# EAGLE design charger-test_2L (EAGLE 7.7.0)
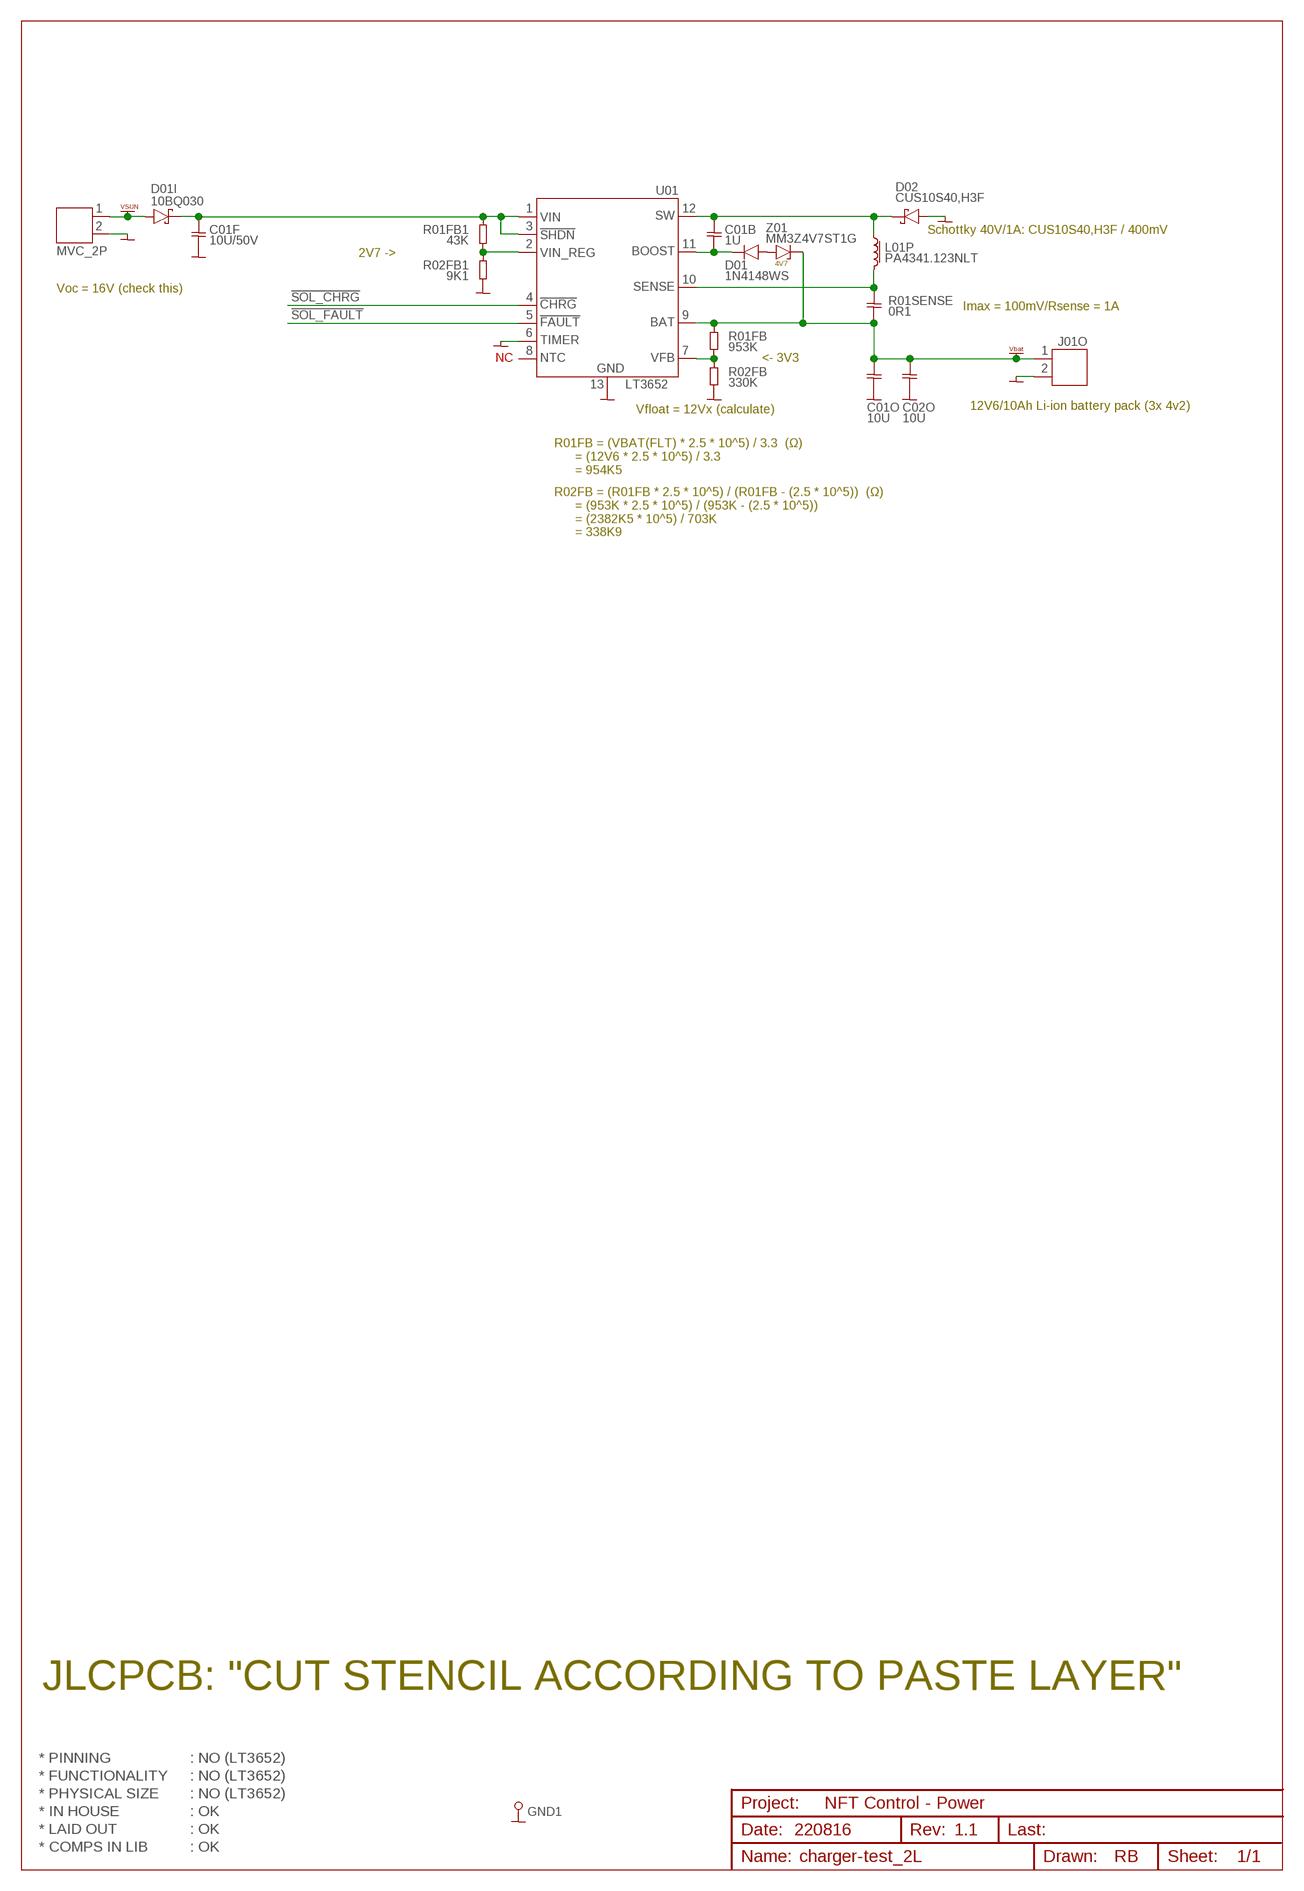
[diagram p0: schematic, sheet 1]

## Parts
C01B  1U  CAP0402  [CAP0402]
C01F  10U/50V  CAP0805  [CAP0805]
C01O  10U  CAP0805  [CAP0805]
C02O  10U  CAP0805  [CAP0805]
D01  1N4148WS  DIODE_1N4148WS  [DIODE_SOD323]
D01I  10BQ030  DIODE_10BQ030  [DIODE_SMB]
D02  CUS10S40,H3F  DIODE_SCHOTTKY_SOD323  [DIODE_SOD323]
GND1  PIN_TEST  [HOLE_PTH_0.8MM]
J01I  MVC_2P  CON_PHOENIX_COMBICON_MCV_HEADER_2P  [CON_PHOENIX_COMBICON_MCV_HEADER_P]
J01O  CON_PHOENIX_COMBICON_MCV_HEADER_2P  [CON_PHOENIX_COMBICON_MCV_HEADER_P]
L01P  PA4341.123NLT  L_PA4341  [L_PA4341]
R01FB  953K  RES0402  [RES0402]
R01FB1  43K  RES0603  [RES0603]
R01SENSE  0R1  CAP0603  [CAP0603]
R02FB  330K  RES0402  [RES0402]
R02FB1  9K1  RES0603  [RES0603]
U01  LT3652  [MSOP-12_GND]
Z01  MM3Z4V7ST1G  ZENER_SOD323  [ZENER_SOD323]

## Nets
!SOL_CHRG: U01.4(4.!CHRG)
!SOL_FAULT: U01.5(5.!FAULT)
BOOST: C01B.2 D01.C(-) U01.11(11.BOOST)
GND: C01F.2 C01O.2 C02O.2 D02.A GND1.1 J01I.2 J01O.2 R02FB1.1 R02FB.1 U01.6(6.TIMER) U01.13(GND_PAD)
N$10: C01F.1 D01I.C(-) R01FB1.2 U01.1(1.VIN) U01.3(3.!SHDN)
N$26: D01.A(+) Z01.A
N$27: R01FB1.1 R02FB1.2 U01.2(2.VIN_REG)
SENSE: L01P.P$2 R01SENSE.2 U01.10(10.SENSE)
SW: C01B.1 D02.C L01P.P$1 U01.12(12.SW)
VBAT: C01O.1 C02O.1 J01O.1 R01FB.2 R01SENSE.1 U01.9(9.BAT) Z01.C
VFB: R01FB.1 R02FB.2 U01.7(7.VFB)
VSUN: D01I.A(+) J01I.1
Unconnected: U01.8(8.NTC)

## Notes on the sheet
- Schottky 40V/1A: CUS10S40,H3F / 400mV
- 2V7 ->
- 4V7
- Voc = 16V (check this)
- Imax = 100mV/Rsense = 1A
- NC | <- 3V3
- Vfloat = 12Vx (calculate) | 12V6/10Ah Li-ion battery pack (3x 4v2)
- R01FB = (VBAT(FLT) * 2.5 * 10^5) / 3.3  (Ω)
        = (12V6 * 2.5 * 10^5) / 3.3
        = 954K5
- R02FB = (R01FB * 2.5 * 10^5) / (R01FB - (2.5 * 10^5))  (Ω)
        = (953K * 2.5 * 10^5) / (953K - (2.5 * 10^5))
        = (2382K5 * 10^5) / 703K
        = 338K9
- JLCPCB: "CUT STENCIL ACCORDING TO PASTE LAYER"
- * PINNING | : NO (LT3652)
- * FUNCTIONALITY | : NO (LT3652)
- * PHYSICAL SIZE | : NO (LT3652)
- NFT Control - Power
- * IN HOUSE | : OK
- * LAID OUT | : OK | 220816 | 1.1
- * COMPS IN LIB | : OK

## Library data of the parts
C01B = 00-own_parts:CAP0402: Capacitor, ceramic, 0402
C01F C01O C02O = 00-own_parts:CAP0805: Capacitor, ceramic, 0805
D01 = 00-own_parts:DIODE_1N4148WS: Diode, 1N4148WS, high speed, 100V/350mA, SOD323
D01I = 00-own_parts:DIODE_10BQ030: Diode, Schottky, 10BQ030, 30V/1A, SMB
D02 = 00-own_parts:DIODE_SCHOTTKY_SOD323: Doide, Schottky, generic, SOD323
GND1 = 00-own_parts:PIN_TEST: Pin, test pad, hole 0.8mm, pad 1.6mm
J01I J01O = 00-own_parts:CON_PHOENIX_COMBICON_MCV_HEADER_2P: Connector, Phoenix, COMBICON MCV, 3.5mm, header, male pins, 2p, 1843619, F#370-4816
L01P = 00-own_parts:L_PA4341: Inductor, case PA4341
R01FB R01FB1 R02FB R02FB1 = 00-own_parts:RES
R01SENSE = 00-own_parts:CAP0603: Capacitor, ceramic, 0603
U01 = 00-own_parts:LT3652: DC/DC converter, battery charger, solar, MMPT, 5..35V/2A, MSOP12-PAD
Z01 = 00-own_parts:ZENER_SOD323: Zener, generic SOD323

## Board
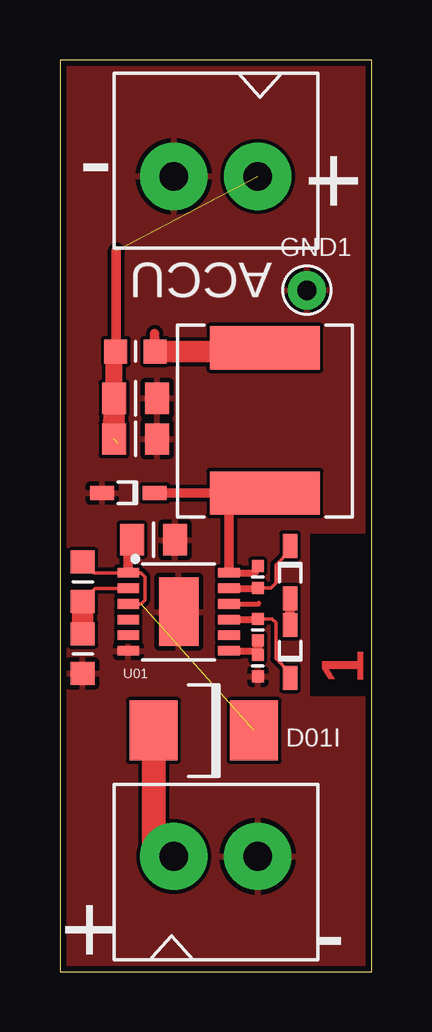
[diagram p1: board, top side]
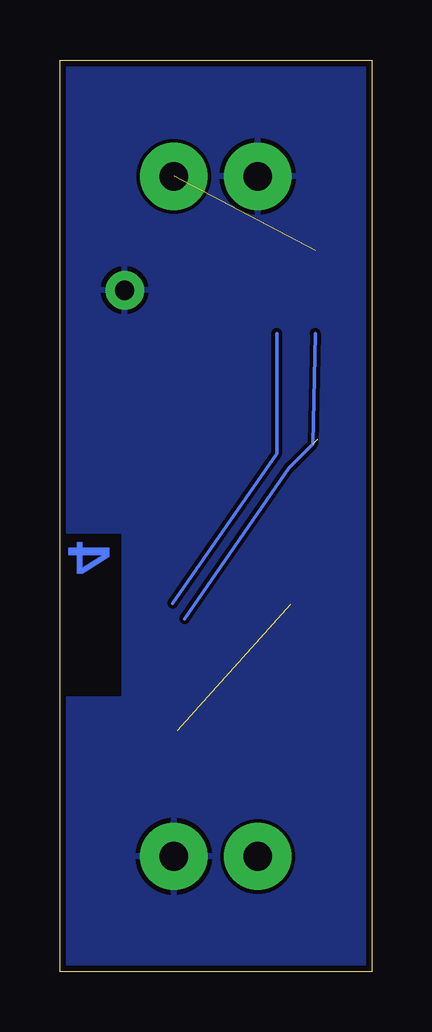
[diagram p2: board, bottom side, seen from below]

Size 13 x 38 mm. Coordinates in mm from the lower left corner, seen from the top.
Outline: 0,38 0,0 13,0 13,38 0,38
Copper layers (1*2*15*16): Top 0.018mm / dielectric 0.36mm / Route2 0.035mm / dielectric 0.71mm / Route15 0.035mm / dielectric 0.36mm / Bottom 0.018mm
Design rules "default": minimum track width 0.15mm, minimum drill 0.2mm, track to track 0.15mm, track to pad 0.15mm, pad to pad 0.15mm, via to via 0.15mm, smd to smd 0mil, copper to edge 0.25mm, drill to drill 0.3mm, minimum pad ring 0.2mm, minimum via ring 0.125mm, stop-mask expansion 0.1mm, vias tented up to drill 0.25mm, thermal gap 0.2mm

### Footprints (pad centres in the part's own frame; a part is rotated, then mirrored left to right if it is on the bottom)
CAP0402 = smd 0.5 x 0.5: 1 -0.45,0; 2 0.45,0
CAP0805 = smd 1 x 1.3: 1 -0.9,0; 2 0.9,0
DIODE_SOD323 = smd 1 x 0.6: A 1.1,0; C -1.1,0
DIODE_SMB = smd 2 x 2.5: A -2.1,0; C 2.1,0
HOLE_PTH_0.8MM = drill 0.8 pad 1.6: 1 0,0
CON_PHOENIX_COMBICON_MCV_HEADER_P = drill 1.2 pad 2.8: 1 -1.75,0; 2 1.75,0
L_PA4341 = smd 1.8 x 4.6: P$1 -3,0; P$2 3.05,0
RES0402 = smd 0.5 x 0.5: 1 -0.45,0; 2 0.45,0
RES0603 = smd 0.95 x 1: 1 -0.821,0.002; 2 0.822,0
CAP0603 = smd 0.95 x 1: 1 -0.821,0.002; 2 0.822,0
MSOP-12_GND = smd 0.9 x 0.4: 1 -2.1,1.625; 2 -2.1,0.975; 3 -2.1,0.325; 4 -2.1,-0.325; 5 -2.1,-0.975; 6 -2.1,-1.625; 7 2.1,-1.625; 8 2.1,-0.975; 9 2.1,-0.325; 10 2.1,0.325; 11 2.1,0.975; 12 2.1,1.625 | smd 1.65 x 2.85: 13 0,0
ZENER_SOD323 = smd 1 x 0.6: A 1.1,0; C -1.1,0

### Placement (x,y rotation side)
C01B  8.25,16.45 270 top
C01F  3.9,18 0 top
C01O  3.15,23.9 0 top
C02O  3.15,22.2 0 top
D01  9.6,16.65 270 top
D01I  6,10.05 0 top
D02  2.85,19.95 180 top
GND1  10.3,28.4 180 top
J01I  6.5,4.8 0 top
J01O  6.5,33.15 180 top
L01P  8.55,22.95 90 top
R01FB  8.25,14.25 90 top
R01FB1  0.95,16.25 90 top
R01SENSE  3.15,25.85 0 top
R02FB  8.25,12.75 90 top
R02FB1  0.95,13.25 90 top
U01  4.95,15 0 top
Z01  9.6,13.35 90 top

### Tracks (layer width: path | path; a pad name or v marks a point on that pad's centre or on a via)
BOOST
  Top 0.15: C01B.2 8.8,16 9,16.2 9,16.95 9.6,17.55 D01.C
  Top 0.3: U01.11 8.12,15.97 C01B.2
GND
  pour Top (rank 6): 13.5,38.05 13.5,0.05 -0.4,0.05 -0.4,38.05
  pour Bottom (rank 6): 13.5,38.05 13.5,0.05 -0.4,0.05 -0.4,38.05
N$10  (1 unrouted)
  Top 0.15: R01FB1.2 1.42,16.62 U01.1 3.38,16.62 3.55,16.45 3.55,15.5 3.38,15.32 U01.3
  Top 0.4: U01.1 2.85,17.85 C01F.1
N$26
  Top 0.4: D01.A Z01.A
N$27
  Top 0.15: U01.2 1.47,15.97 R01FB1.1
  Top 0.9: R02FB1.2 R01FB1.1
N$46
  cutout Top: 10.45,11.5 10.45,18.25 13,18.25 13,11.5
  cutout Bottom: 10.45,11.5 10.45,18.25 13,18.25 13,11.5
SENSE  (2 unrouted)
  Top 0.2: U01.10 8.28,15.32 8.3,15.35 | R01SENSE.2 3.95,25.87
  Top 0.4: 3.95,25.87 3.95,26.6
  Top 0.9: R01SENSE.2 8.55,25.85 L01P.P$2
  Bottom 0.15: 8.3,15.35 3.95,21.6 3.95,26.6
SW
  Top 0.3: U01.12 8.12,16.62 C01B.1
  Top 0.4: U01.12 7.05,19.6 7.2,19.6 | 7.2,19.6 8.2,19.6 L01P.P$1 | D02.C 6.85,19.95 7.2,19.6
VBAT  (3 unrouted)
  Top 0.15: R01SENSE.1 2.35,25.87 | R01FB.2 8.85,14.7 9,14.55 9,13.05 9.6,12.45 Z01.C
  Top 0.2: R01FB.2 7.8,14.7
  Top 0.3: U01.9 8.07,14.68 R01FB.2
  Top 0.4: 2.35,25.87 2.35,30.05
  Top 0.7: C01O.1 2.25,25.77 R01SENSE.1
  Top 0.9: C02O.1 2.25,22.95 | 2.25,22.95 C01O.1 | 2.25,22.95 | R01SENSE.1
  Bottom 0.15: 7.8,14.7 3.45,21 2.45,22 2.35,26.6
VFB
  Top 0.3: U01.7 8.07,13.38 R02FB.2
  Top 0.4: R01FB.1 R02FB.2
VSUN
  Top 1: D01I.A 3.9,5.15 J01I.1

### Text on the board
Top: 1
Bottom: 4
tPlace: - | + | ACCU | + | -